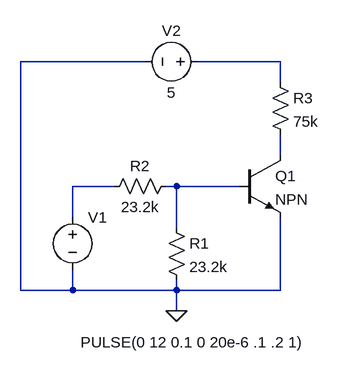
[diagram p0: schematic input_protection.asc]
input_protection.asc, the LTspice schematic file:
Version 4
SHEET 1 880 680
WIRE 112 -80 -80 -80
WIRE 320 -80 192 -80
WIRE 320 -48 320 -80
WIRE 320 64 320 32
WIRE 64 112 0 112
WIRE 160 112 144 112
WIRE 256 112 160 112
WIRE 0 160 0 112
WIRE 160 176 160 112
WIRE -80 272 -80 -80
WIRE 0 272 0 240
WIRE 0 272 -80 272
WIRE 160 272 160 256
WIRE 160 272 0 272
WIRE 320 272 320 160
WIRE 320 272 160 272
WIRE 160 304 160 272
FLAG 160 304 0
SYMBOL voltage 0 144 R0
WINDOW 3 12 208 Left 2
WINDOW 123 0 0 Left 2
WINDOW 39 0 0 Left 2
SYMATTR Value PULSE(0 12 0.1 0 20e-6 .1 .2 1)
SYMATTR InstName V1
SYMBOL npn 256 64 R0
SYMATTR InstName Q1
SYMBOL res 144 160 R0
SYMATTR InstName R1
SYMATTR Value 23.2k
SYMBOL res 160 96 R90
WINDOW 0 0 56 VBottom 2
WINDOW 3 32 56 VTop 2
SYMATTR InstName R2
SYMATTR Value 23.2k
SYMBOL voltage 208 -80 R90
WINDOW 0 -32 56 VBottom 2
WINDOW 3 32 56 VTop 2
WINDOW 123 0 0 Left 2
WINDOW 39 0 0 Left 2
SYMATTR InstName V2
SYMATTR Value 5
SYMBOL res 304 -64 R0
SYMATTR InstName R3
SYMATTR Value 75k

The netlist it stands for:
* input_protection.asc
V1 N003 0 PULSE(0 12 0.1 0 20e-6 .1 .2 1)
Q1 N002 N004 0 0 NPN
R1 N004 0 23.2k
R2 N004 N003 23.2k
V2 N001 0 5
R3 N001 N002 75k
.model NPN NPN
.model PNP PNP
.lib standard.bjt
.backanno
.end